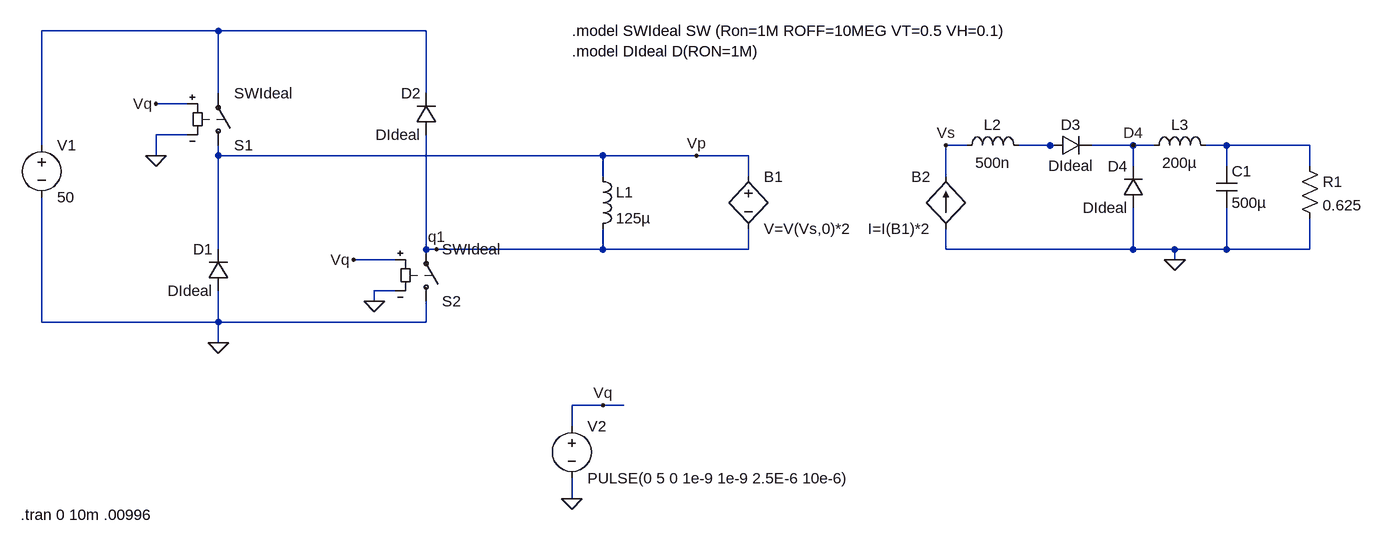
[diagram p0: schematic q1_withLeak.asc]
q1_withLeak.asc, the LTspice schematic file:
Version 4
SHEET 1 2024 728
WIRE 256 -32 -16 -32
WIRE 576 -32 256 -32
WIRE 256 64 256 -32
WIRE 576 64 576 -32
WIRE 208 80 160 80
WIRE 208 128 160 128
WIRE -16 144 -16 -32
WIRE 1408 144 1376 144
WIRE 1536 144 1488 144
WIRE 1552 144 1536 144
WIRE 1664 144 1600 144
WIRE 1696 144 1664 144
WIRE 1808 144 1776 144
WIRE 1936 144 1808 144
WIRE 160 160 160 128
WIRE 256 160 256 144
WIRE 848 160 256 160
WIRE 992 160 848 160
WIRE 1072 160 992 160
WIRE 1664 176 1664 144
WIRE 1808 176 1808 144
WIRE 1936 176 1936 144
WIRE 848 192 848 160
WIRE 1072 192 1072 160
WIRE 1376 192 1376 144
WIRE 256 304 256 160
WIRE 576 304 576 128
WIRE 592 304 576 304
WIRE 848 304 848 272
WIRE 848 304 592 304
WIRE 1072 304 1072 272
WIRE 1072 304 848 304
WIRE 1376 304 1376 272
WIRE 1664 304 1664 240
WIRE 1664 304 1376 304
WIRE 1728 304 1664 304
WIRE 1808 304 1808 240
WIRE 1808 304 1728 304
WIRE 1936 304 1936 256
WIRE 1936 304 1808 304
WIRE 528 320 464 320
WIRE 1728 320 1728 304
WIRE 528 368 496 368
WIRE 496 384 496 368
WIRE -16 416 -16 224
WIRE 256 416 256 368
WIRE 256 416 -16 416
WIRE 576 416 576 384
WIRE 576 416 256 416
WIRE 256 448 256 416
WIRE 848 544 800 544
WIRE 880 544 848 544
WIRE 800 576 800 544
WIRE 800 688 800 656
FLAG 256 448 0
FLAG 1728 320 0
FLAG 800 688 0
FLAG 848 544 Vq
FLAG 160 80 Vq
FLAG 464 320 Vq
FLAG 160 160 0
FLAG 496 384 0
FLAG 1376 144 Vs
FLAG 992 160 Vp
FLAG 592 304 q1
FLAG 1664 144 D4
SYMBOL voltage -16 128 R0
WINDOW 123 0 0 Left 0
WINDOW 39 0 0 Left 0
SYMATTR InstName V1
SYMATTR Value 50
SYMBOL sw 256 160 M180
SYMATTR InstName S1
SYMATTR Value SWIdeal
SYMBOL sw 576 400 M180
SYMATTR InstName S2
SYMATTR Value SWIdeal
SYMBOL diode 272 368 R180
WINDOW 0 24 64 Left 2
WINDOW 3 24 0 Left 2
SYMATTR InstName D1
SYMATTR Value DIdeal
SYMBOL diode 592 128 R180
WINDOW 0 24 64 Left 2
WINDOW 3 24 0 Left 2
SYMATTR InstName D2
SYMATTR Value DIdeal
SYMBOL ind 832 176 R0
SYMATTR InstName L1
SYMATTR Value 125µ
SYMBOL bv 1072 176 R0
SYMATTR InstName B1
SYMATTR Value V=V(Vs,0)*2
SYMBOL bi 1376 272 R180
WINDOW 0 24 80 Left 2
WINDOW 3 24 0 Left 2
SYMATTR InstName B2
SYMATTR Value I=I(B1)*2
SYMBOL diode 1536 160 R270
WINDOW 0 32 32 VTop 2
WINDOW 3 0 32 VBottom 2
SYMATTR InstName D3
SYMATTR Value DIdeal
SYMBOL diode 1680 240 R180
WINDOW 0 24 64 Left 2
WINDOW 3 24 0 Left 2
SYMATTR InstName D4
SYMATTR Value DIdeal
SYMBOL cap 1792 176 R0
SYMATTR InstName C1
SYMATTR Value 500µ
SYMBOL res 1920 160 R0
SYMATTR InstName R1
SYMATTR Value 0.625
SYMBOL voltage 800 560 R0
WINDOW 123 0 0 Left 0
WINDOW 39 0 0 Left 0
SYMATTR InstName V2
SYMATTR Value PULSE(0 5 0 1e-9 1e-9 2.5E-6 10e-6)
SYMBOL ind 1680 160 R270
WINDOW 0 32 56 VTop 2
WINDOW 3 5 56 VBottom 2
SYMATTR InstName L3
SYMATTR Value 200µ
SYMBOL ind 1392 160 R270
WINDOW 0 32 56 VTop 2
WINDOW 3 5 56 VBottom 2
SYMATTR InstName L2
SYMATTR Value 500n
TEXT 800 -32 Left 2 !.model SWIdeal SW (Ron=1M ROFF=10MEG VT=0.5 VH=0.1)\n.model DIdeal D(RON=1M)
TEXT -48 712 Left 2 !.tran 0 10m .00996

The netlist it stands for:
* q1_withLeak.asc
V1 N001 0 50
S1 Vp N001 Vq 0 SWIdeal
S2 0 q1 Vq 0 SWIdeal
D1 0 Vp DIdeal
D2 q1 N001 DIdeal
L1 Vp q1 125µ
B1 Vp q1 V=V(Vs,0)*2
B2 0 Vs I=I(B1)*2
D3 N002 D4 DIdeal
D4 0 D4 DIdeal
C1 N003 0 500µ
R1 N003 0 0.625
V2 Vq 0 PULSE(0 5 0 1e-9 1e-9 2.5E-6 10e-6)
L3 D4 N003 200µ
L2 Vs N002 500n
.model D D
.lib standard.dio
.model SWIdeal SW (Ron=1M ROFF=10MEG VT=0.5 VH=0.1)
.model DIdeal D(RON=1M)
.tran 0 10m .00996
.backanno
.end